# EAGLE schematic V1_SENSOR (EAGLE 6.4)
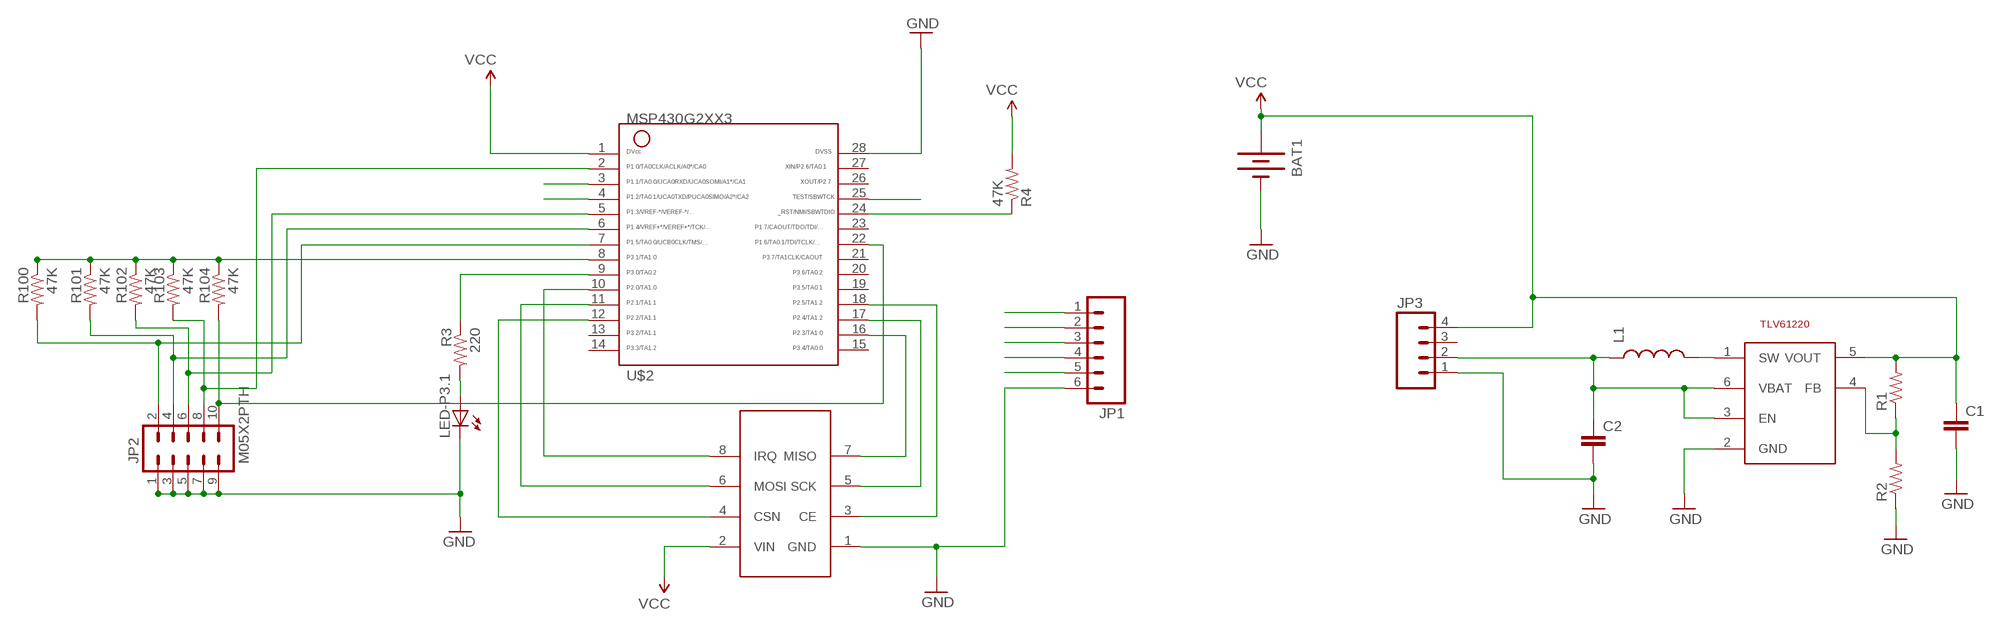
[diagram p0: schematic, sheet 1]

## Parts
BAT1  BATTERY20PTH  [BATTCOM_20MM_PTH]
C1  CAP0805  [0805]
C2  CAP0805  [0805]
JP1  M06LOCK  [1X06_LOCK]
JP2  M05X2PTH  [AVR_ICSP]
JP3  M04LOCK  [1X04_LOCK]
L1  INDUCTOR0805  [0805]
LED-P3.1  LED0805  [LED-0805]
R1  RESISTOR0805-RES  [0805]
R2  RESISTOR0805-RES  [0805]
R3  220  RESISTOR0805-RES  [0805]
R4  47K  RESISTOR0805-RES  [0805]
R100  47K  RESISTOR0805-RES  [0805]
R101  47K  RESISTOR0805-RES  [0805]
R102  47K  RESISTOR0805-RES  [0805]
R103  47K  RESISTOR0805-RES  [0805]
R104  47K  RESISTOR0805-RES  [0805]
U1  NRF24L01-4X2  [NRF24L01-4X2]
U$1  TLV61220  TI-TLV61220  [SOT23-6L]
U$2  MSP430G2553  G2XX3---PW28  [PW28]

## Nets
GND: BAT1.2(-) C1.2 C2.2 JP1.6 JP2.1 JP2.3 JP2.5 JP2.7 JP2.9 JP3.1 LED-P3.1.C R2.1 U1.1(GND) U$1.2(GND) U$2.28
N$1: R100.1 R101.1 R102.1 R103.1 R104.1 U$2.8
N$13: L1.2 U$1.1(SW)
N$14: R1.1 R2.2 U$1.4(FB)
N$15: LED-P3.1.A R3.2
N$17: U1.3(CE) U$2.18
N$18: U1.5(SCK) U$2.17
N$19: U1.7(MISO) U$2.16
N$20: U1.6(MOSI) U$2.11
N$21: U1.4(CSN) U$2.12
N$22: U1.8(IRQ) U$2.10
N$23: R3.1 U$2.9
P1.0: JP2.8 R103.2 U$2.2
P1.3: JP2.6 R102.2 U$2.5
P1.4: JP2.4 R101.2 U$2.6
P1.5: JP2.2 R100.2 U$2.7
P1.6: JP2.10 R104.2 U$2.22
RESET: JP1.5 R4.1 U$2.24
RXD: JP1.2 U$2.3
TEST: JP1.4 U$2.25
TXD: JP1.3 U$2.4
VCC: BAT1.1(+) C1.1 JP1.1 JP3.4 R1.2 R4.2 U1.2(VIN) U$1.5(VOUT) U$2.1
VIN: C2.1 JP3.2 L1.1 U$1.3(EN) U$1.6(VBAT)
Unconnected: JP3.3 U$2.13 U$2.14 U$2.15 U$2.19 U$2.20 U$2.21 U$2.23 U$2.26 U$2.27

## Library data of the parts
BAT1 = SparkFun-Electromechanical:BATTERY: Battery Holders Various common sizes : AA, AAA, 20mm coin cell and 12mm coin cell. 20MM_4LEGS, BATT-10373
C1 C2 = SparkFun-Passives:CAP: Capacitor Standard 0603 ceramic capacitor, and 0.1" leaded capacitor.
JP1 = SparkFun-Connectors:M06: Header 6 Standard 6-pin 0.1" header. Use with straight break away headers (SKU : PRT-00116), right angle break away headers (PRT-00553), swiss pins (PRT-00743), machine pins (PRT-00117), and female headers (PRT-00115). Molex polarized connector foot print use with SKU : PRT-08094 with associated crimp pins and housings. NOTES ON THE VARIANTS LOCK and LOCK_LONGPADS... This footprint was designed to help hold the alignment of a through-hole component (i.e. 6-pin header) while soldering it into place. You may notice that each hole has been shifted either up or down by 0.005 of an inch from it's more standard position (which is a perfectly straight line). This slight alteration caused the pins (the squares in the middle) to touch the edges of the holes. Because they are alternating, it causes a "brace" to hold the component in place. 0.005 has proven to be the perfect amount of "off-center" position when using our standard breakaway headers. Although looks a little odd when you look at the bare footprint, once you have a header in there, the alteration is very hard to notice. Also, if you push a header all the way into place, it is covered up entirely on the bottom side. This idea of altering the position of holes to aid alignment will be further integrated into the Sparkfun Library for other footprints. It can help hold any component with 3 or more connection pins.
JP2 = SparkFun-Connectors:M05X2: Header 5x2 Standard 10-pin dual row 0.1" header. Commonly used with AVR-ISP. Use with Spark Fun Electronics SKU: PRT-00778
JP3 = SparkFun-Connectors:M04: Header 4 Standard 4-pin 0.1" header. Use with straight break away headers (SKU : PRT-00116), right angle break away headers (PRT-00553), swiss pins (PRT-00743), machine pins (PRT-00117), and female headers (PRT-00115). Molex polarized connector foot print use with SKU : PRT-08231 with associated crimp pins and housings. 1MM SMD Version SKU: PRT-10208
L1 = SparkFun-Passives:INDUCTOR: Inductors Basic Inductor/Choke - 0603 and 1206. Footprints are not proven and vary greatly between part numbers.
LED-P3.1 = custom:LED: SMD LEDs 0603- DIO 0805- DIO 1206- DIO
R1 R2 = SparkFun-Passives:RESISTOR: Resistor Basic schematic elements and footprints for 0603, 1206, and PTH resistors.
R3 R4 R100-R104 = SparkFun-Resistors:RESISTOR: Resistor Basic schematic elements and footprints for 0603, 1206, and PTH resistors.
U1 = untitled:NRF24L01-4X2
U$1 = custom:TI-TLV61220
U$2 = TI_MSP430_v16:G2XX3---PW28: MSP430G2XX1 TSSOP (PW) 28 Pin Package